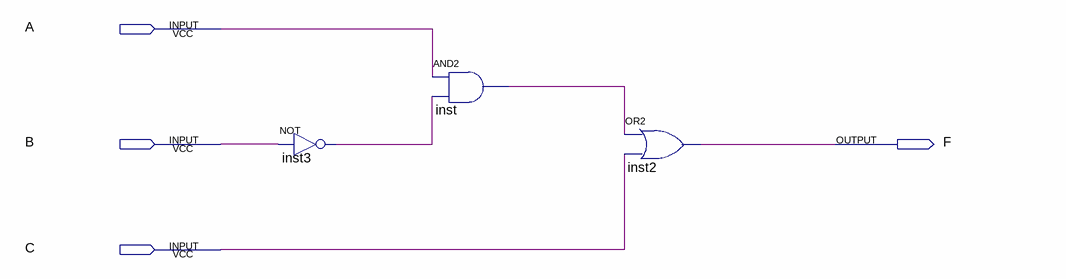
[diagram p0: schematic sheet]
// Quartus schematic lab_01.bdf as structural Verilog: 3 symbols, 4 pins
module lab_01 (
  input  A,
  input  B,
  input  C,
  output F
);

  wire inst3_out, inst_out;

  not inst3 (inst3_out, B);
  and inst (inst_out, A, inst3_out);
  or inst2 (F, inst_out, C);
endmodule
